# EAGLE schematic HW2_ME433 (EAGLE 9.3.0)
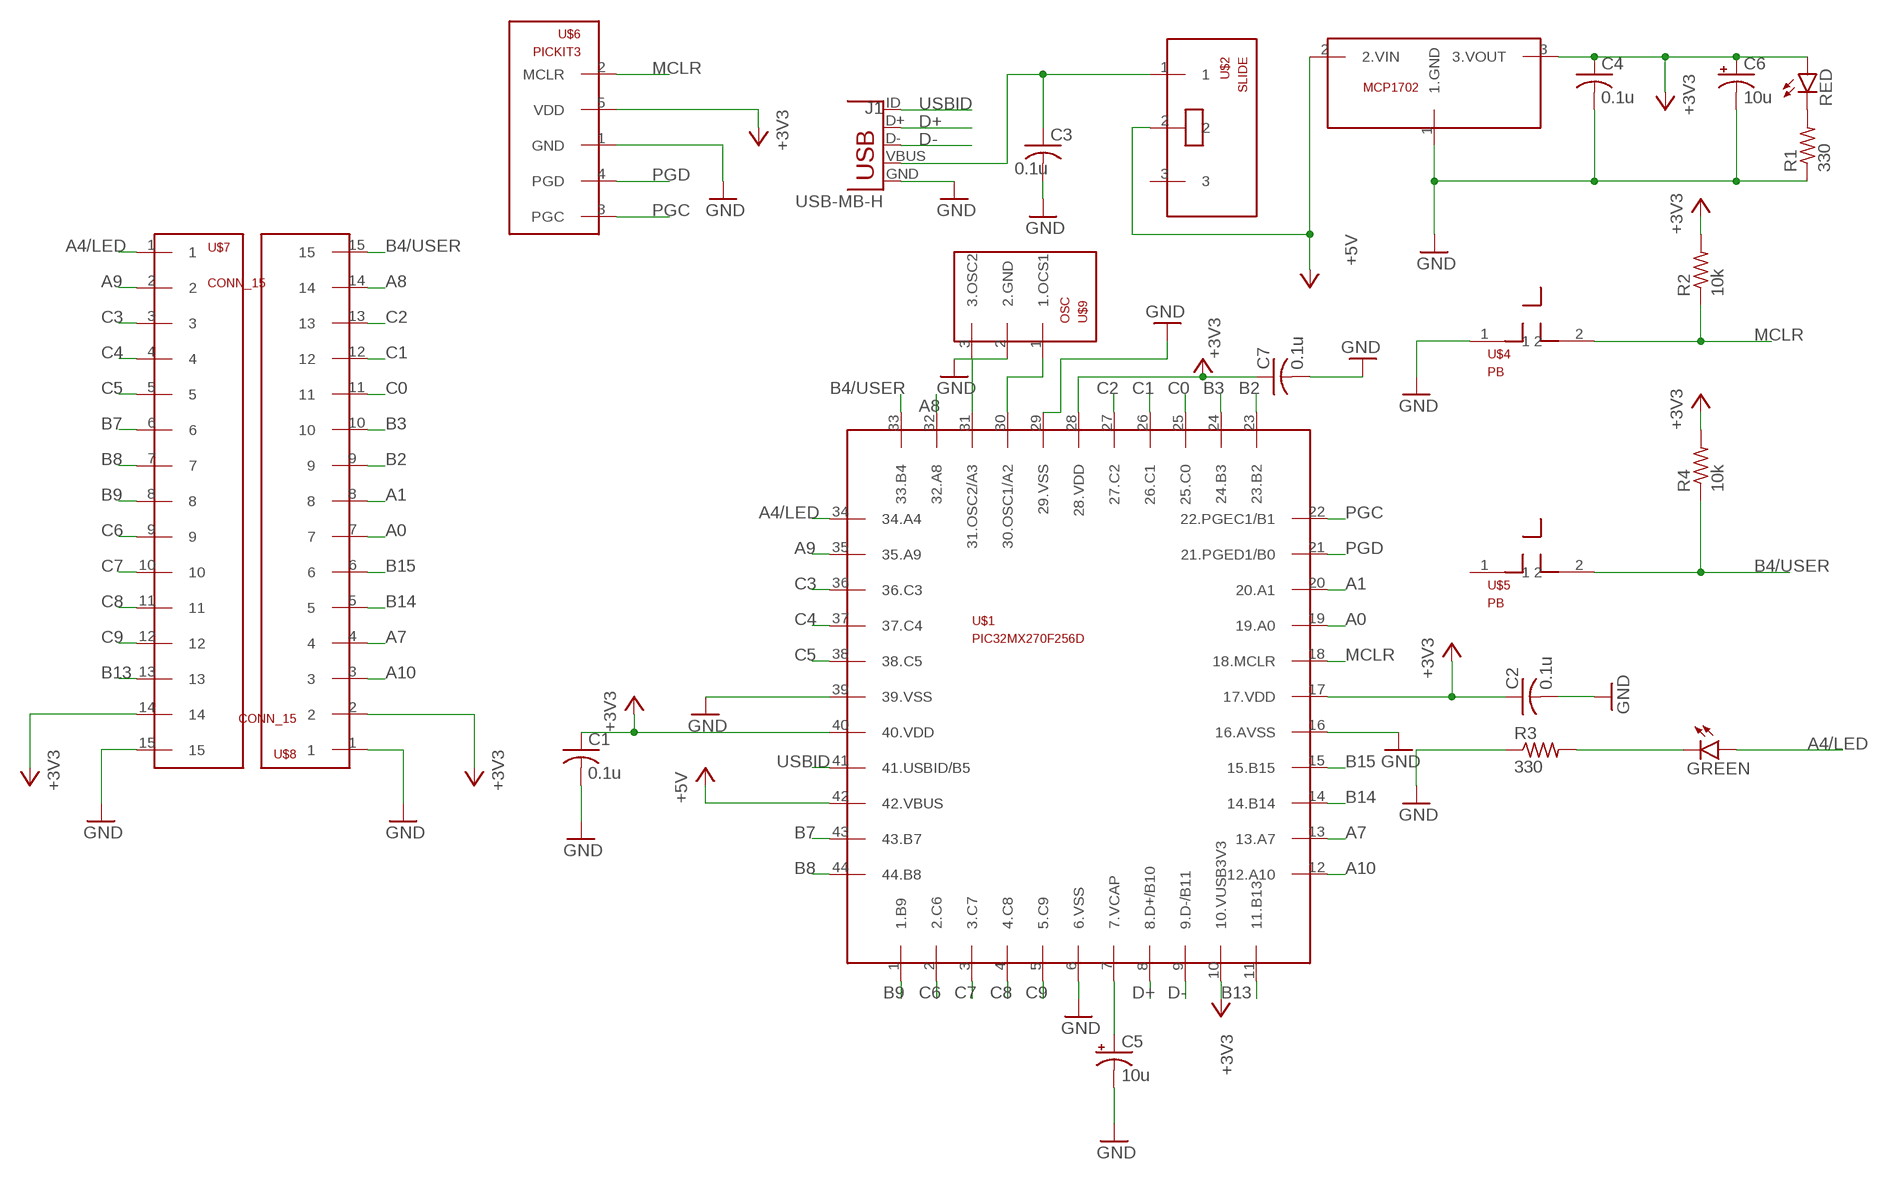
[diagram p0: schematic, sheet 1]

## Parts
C1  0.1u  C-US025-030X050  [C025-030X050]
C2  0.1u  C-US025-030X050  [C025-030X050]
C3  0.1u  C-US025-030X050  [C025-030X050]
C4  0.1u  C-US025-030X050  [C025-030X050]
C5  10u  CPOL-USB45181B  [B45181B]
C6  10u  CPOL-USB45181B  [B45181B]
C7  0.1u  C-US025-025X050  [C025-025X050]
GREEN  LED3MM  [LED3MM]
J1  USB-MB-H  [USB-MB-H]
R1  330  R-US_0207/10  [0207/10]
R2  10k  R-US_0207/10  [0207/10]
R3  330  R-US_0207/10  [0207/10]
R4  10k  R-US_0207/10  [0207/10]
RED  LED3MM  [LED3MM]
U$1  PIC32MX270F256D  [TQFP44]
U$2  SLIDE  [SLIDE]
U$3  MCP1702  [TO92]
U$4  PB  [PB]
U$5  PB  [PB]
U$6  PICKIT3  [1X05]
U$7  CONN_15  [CONN_15]
U$8  CONN_15  [CONN_15]
U$9  OSC  [OSC]

## Nets
+3V3: C1.1 C2.1 C4.1 C6.+ C7.1 R2.2 R4.2 RED.A U$1.10(10.VUSB3V3) U$1.17(17.VDD) U$1.28(28.VDD) U$1.40(40.VDD) U$3.3(3.VOUT) U$6.5(VDD) U$7.14 U$8.2
+5V: U$1.42(42.VBUS)
A0: U$1.19(19.A0) U$8.7
A1: U$1.20(20.A1) U$8.8
A4/LED: GREEN.A U$1.34(34.A4) U$7.1
A7: U$1.13(13.A7) U$8.4
A8: U$1.32(32.A8) U$8.14
A9: U$1.35(35.A9) U$7.2
A10: U$1.12(12.A10) U$8.3
B2: U$1.23(23.B2) U$8.9
B3: U$1.24(24.B3) U$8.10
B4/USER: R4.1 U$1.33(33.B4) U$5.2 U$8.15
B7: U$1.43(43.B7) U$7.6
B8: U$1.44(44.B8) U$7.7
B9: U$1.1(1.B9) U$7.8
B13: U$1.11(11.B13) U$7.13
B14: U$1.14(14.B14) U$8.5
B15: U$1.15(15.B15) U$8.6
C0: U$1.25(25.C0) U$8.11
C1: U$1.26(26.C1) U$8.12
C2: U$1.27(27.C2) U$8.13
C3: U$1.36(36.C3) U$7.3
C4: U$1.37(37.C4) U$7.4
C5: U$1.38(38.C5) U$7.5
C6: U$1.2(2.C6) U$7.9
C7: U$1.3(3.C7) U$7.10
C8: U$1.4(4.C8) U$7.11
C9: U$1.5(5.C9) U$7.12
D+: J1.D+ U$1.8(8.D+/B10)
D-: J1.D- U$1.9(9.D-/B11)
GND: C1.2 C2.2 C3.2 C4.2 C5.- C6.- C7.2 J1.GND R1.1 R3.1 U$1.6(6.VSS) U$1.16(16.AVSS) U$1.29(29.VSS) U$1.39(39.VSS) U$3.1(1.GND) U$4.1 U$6.1(GND) U$7.15 U$8.1 U$9.2(2.GND)
MCLR: R2.1 U$1.18(18.MCLR) U$4.2 U$6.2(MCLR)
N$1: U$1.31(31.OSC2/A3) U$9.3(3.OSC2)
N$2: U$1.30(30.OSC1/A2) U$9.1(1.OCS1)
N$3: GREEN.K(C) R3.2
N$4: C5.+ U$1.7(7.VCAP)
N$9: C3.1 J1.VBUS U$2.1
N$10: R1.2 RED.K(C)
PGC: U$1.22(22.PGEC1/B1) U$6.3(PGC)
PGD: U$1.21(21.PGED1/B0) U$6.4(PGD)
USBID: J1.ID U$1.41(41.USBID/B5) U$2.2 U$3.2(2.VIN) ; supply symbol labelled +5V
Unconnected: U$2.3 U$5.1

## Library data of the parts
C1-C4 C7 = HW2_ME433:C-US: CAPACITOR, American symbol; SPICEPREFIX: C
C5 C6 = HW2_ME433:CPOL-US: POLARIZED CAPACITOR, American symbol; SPICEPREFIX: C
GREEN RED = led:LED: LED OSRAM: - CHIPLED LG R971, LG N971, LY N971, LG Q971, LY Q971, LO R971, LY R971 LH N974, LH R974 LS Q976, LO Q976, LY Q976 LO Q996 - Hyper CHIPLED LW Q18S LB Q993, LB Q99A, LB R99A - SideLED LS A670, LO A670, LY A670, LG A670, LP A670 LB A673, LV A673, LT A673, LW A673 LH A674 LY A675 LS A676, LA A676, LO A676, LY A676, LW A676 LS A679, LY A679, LG A679 - Hyper Micro SIDELED® LS Y876, LA Y876, LO Y876, LY Y876 LT Y87S - SmartLED LW L88C, LW L88S LB L89C, LB L89S, LG L890 LS L89K, LO L89K, LY L89K LS L896, LA L896, LO L896, LY L896 - TOPLED LS T670, LO T670, LY T670, LG T670, LP T670 LSG T670, LSP T670, LSY T670, LOP T670, LYG T670 LG T671, LOG T671, LSG T671 LB T673, LV T673, LT T673, LW T673 LH T674 LS T676, LA T676, LO T676, LY T676, LB T676, LH T676, LSB T676, LW T676 LB T67C, LV T67C, LT T67C, LS T67K, LO T67K, LY T67K, LW E67C LS E67B, LA E67B, LO E67B, LY E67B, LB E67C, LV E67C, LT E67C LW T67C LS T679, LY T679, LG T679 LS T770, LO T770, LY T770, LG T770, LP T770 LB T773, LV T773, LT T773, LW T773 LH T774 LS E675, LA E675, LY E675, LS T675 LS T776, LA T776, LO T776, LY T776, LB T776 LHGB T686 LT T68C, LB T68C - Hyper Mini TOPLED® LB M676 - Mini TOPLED Santana® LG M470 LS M47K, LO M47K, LY M47K Source: http://www.osram.convergy.de LUXEON: - LUMILED® LXK2-PW12-R00, LXK2-PW12-S00, LXK2-PW14-U00, LXK2-PW14-V00 LXK2-PM12-R00, LXK2-PM12-S00, LXK2-PM14-U00 LXK2-PE12-Q00, LXK2-PE12-R00, LXK2-PE12-S00, LXK2-PE14-T00, LXK2-PE14-U00 LXK2-PB12-K00, LXK2-PB12-L00, LXK2-PB12-M00, LXK2-PB14-N00, LXK2-PB14-P00, LXK2-PB14-Q00 LXK2-PR12-L00, LXK2-PR12-M00, LXK2-PR14-Q00, LXK2-PR14-R00 LXK2-PD12-Q00, LXK2-PD12-R00, LXK2-PD12-S00 LXK2-PH12-R00, LXK2-PH12-S00 LXK2-PL12-P00, LXK2-PL12-Q00, LXK2-PL12-R00 Source: www.luxeon.com KINGBRIGHT: KA-3528ASYC Source: www.kingbright.com
J1 = HW2_ME433:USB: USB Connectors USB-B-PTH is fully proven SKU : PRT-00139/CONN-08278 USB-miniB is fully proven SKU : PRT-00587 USB-A-PCB is untested. USB-A-H is throughly reviewed, but untested. Spark Fun Electronics SKU : PRT-00437 USB-B-SMT is throughly reviewed, but untested. Needs silkscreen touching up. USB-A-S has not been used/tested USB-MB-H has not been used/tested USB-MICROB has been used. CONN-09505
R1-R4 = HW2_ME433:R-US_: RESISTOR, American symbol; SPICEPREFIX: R
U$1 = HW2_ME433:PIC32MX270F256D
U$2 = HW2_ME433:SLIDE
U$3 = HW2_ME433:MCP1702
U$4 U$5 = HW2_ME433:PB
U$6 = HW2_ME433:PICKIT3
U$7 U$8 = HW2_ME433:CONN_15
U$9 = HW2_ME433:OSC